# Altium schematic sheet DCDC_Top.SchDoc
size A4; SheetNumber: 1; SheetTotal: 1
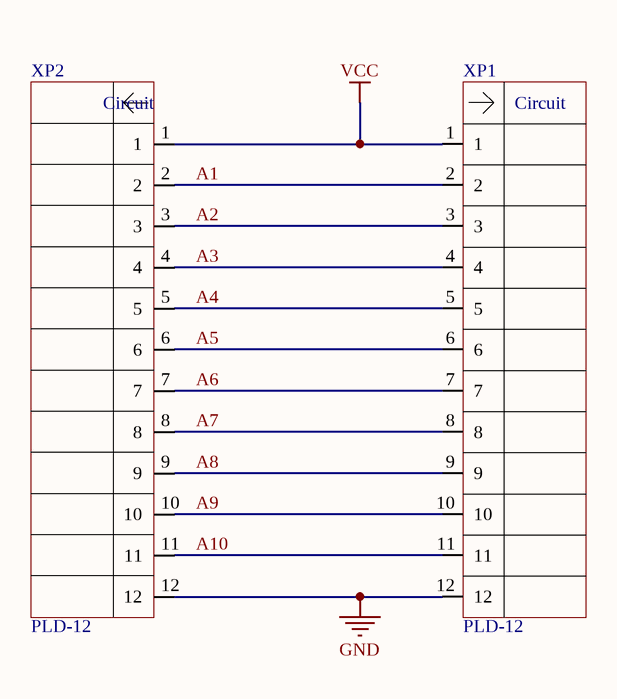
[diagram p0: DCDC_Top.SchDoc]

## Parts
XP1  PLD-12  [PLD-12-3D]
XP2  PLD-12  [PLD-12-3D]

## Nets
GND: XP1.12 XP2.12
VCC: XP1.1 XP2.1
A1: XP1.2 XP2.2
A2: XP1.3 XP2.3
A3: XP1.4 XP2.4
A4: XP1.5 XP2.5
A5: XP1.6 XP2.6
A6: XP1.7 XP2.7
A7: XP1.8 XP2.8
A8: XP1.9 XP2.9
A9: XP1.10 XP2.10
A10: XP1.11 XP2.11

## Notes on the sheet
- (in symbol PLD-12) Circuit

## Library data of the parts
XP1 = PLD-12: System: Connector; Part Number: PLD-12
XP2 = PLD-12: Part Number: PLD-12